# EAGLE schematic od2r_redraw (EAGLE 9.6.0)
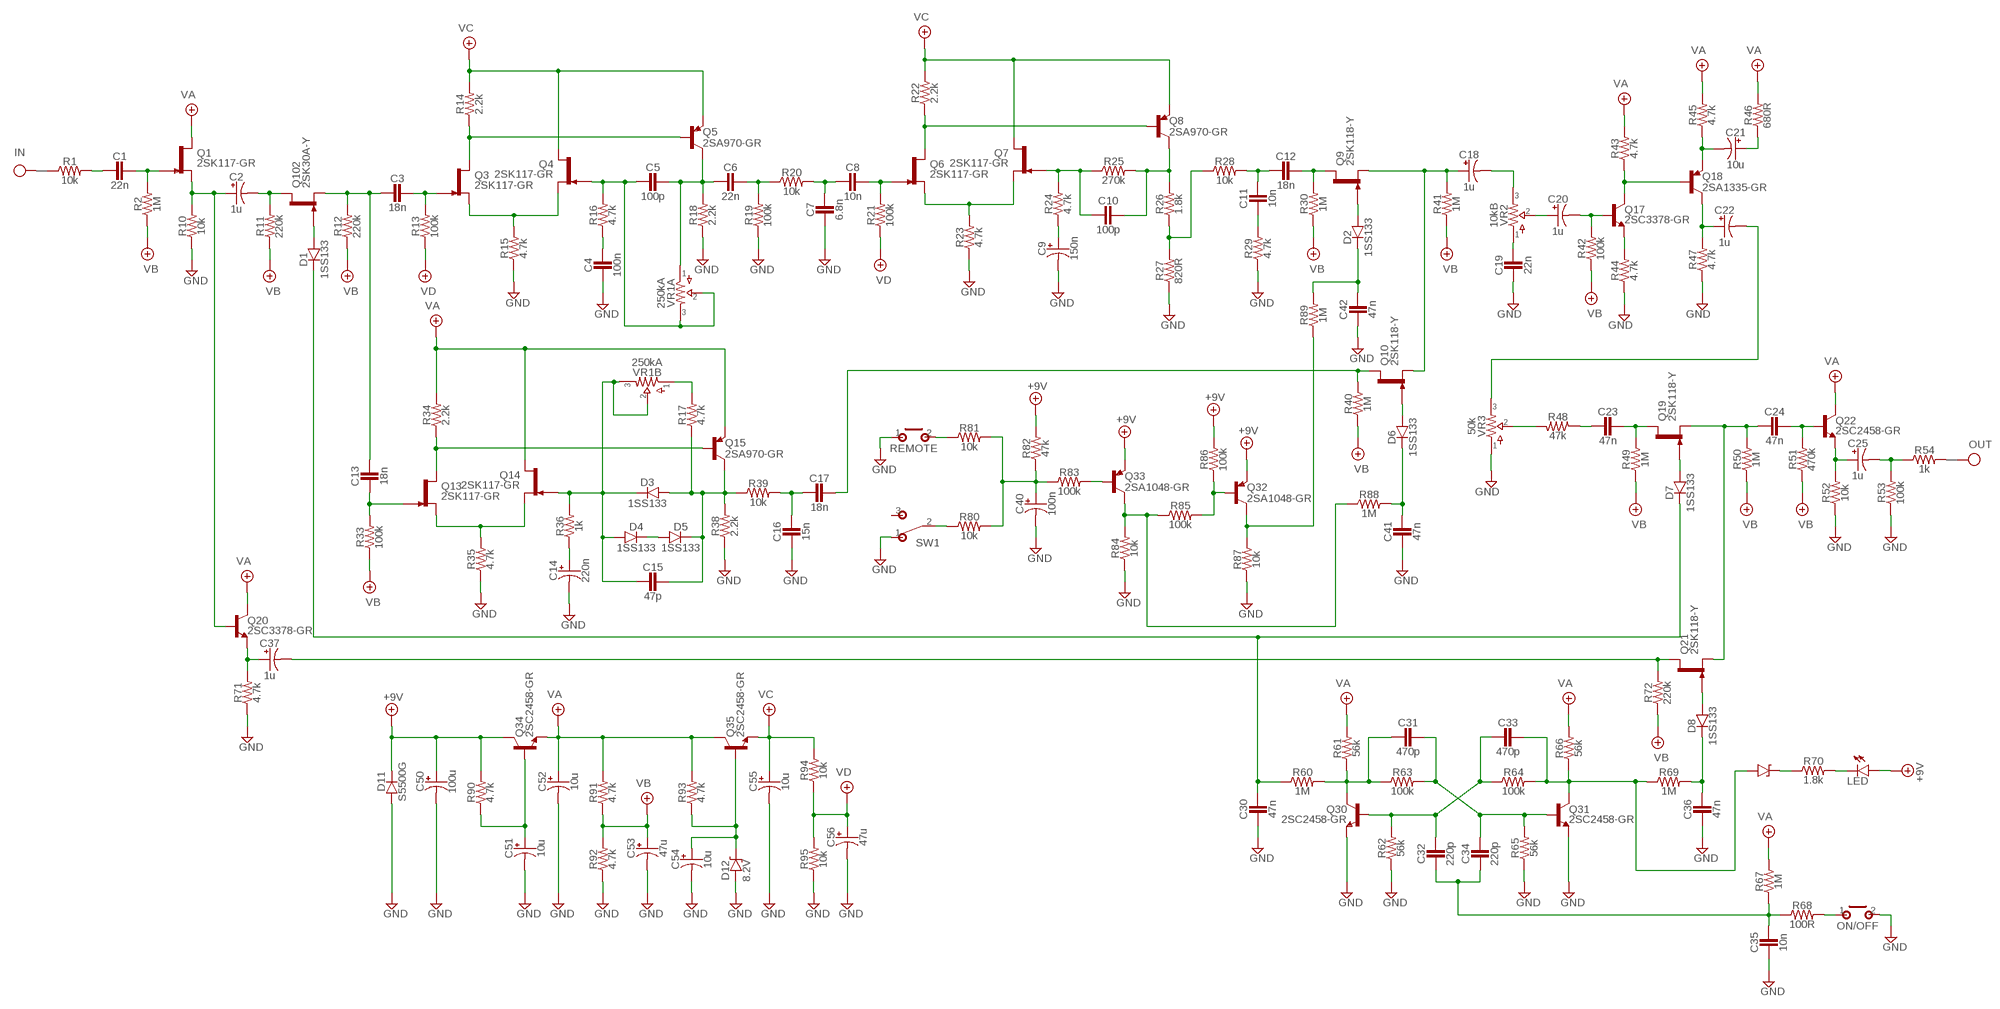
[diagram p0: schematic, sheet 1]

## Parts
C1  22n  CER/FILMBOX.1  [BOX_SMALL]
C2  1u  0400  [040_020]
C3  18n  CER/FILMBOX.1  [BOX_SMALL]
C4  100n  CER/FILMBOX.1  [BOX_SMALL]
C5  100p  CER/FILMBOX.1  [BOX_SMALL]
C6  22n  CER/FILMBOX.1  [BOX_SMALL]
C7  6.8n  CER/FILMBOX.1  [BOX_SMALL]
C8  10n  CER/FILMBOX.1  [BOX_SMALL]
C9  150n  0400  [040_020]
C10  100p  CER/FILMBOX.1  [BOX_SMALL]
C11  10n  CER/FILMBOX.1  [BOX_SMALL]
C12  18n  CER/FILMBOX.1  [BOX_SMALL]
C13  18n  CER/FILMBOX.1  [BOX_SMALL]
C14  220n  0400  [040_020]
C15  47p  CER/FILMBOX.1  [BOX_SMALL]
C16  15n  CER/FILMBOX.1  [BOX_SMALL]
C17  18n  CER/FILMBOX.1  [BOX_SMALL]
C18  1u  0400  [040_020]
C19  22n  CER/FILMBOX.1  [BOX_SMALL]
C20  1u  0400  [040_020]
C21  10u  0400  [040_020]
C22  1u  0400  [040_020]
C23  47n  CER/FILMBOX.1  [BOX_SMALL]
C24  47n  CER/FILMBOX.1  [BOX_SMALL]
C25  1u  0400  [040_020]
C30  47n  CER/FILMBOX.1  [BOX_SMALL]
C31  470p  CER/FILMBOX.1  [BOX_SMALL]
C32  220p  CER/FILMBOX.1  [BOX_SMALL]
C33  470p  CER/FILMBOX.1  [BOX_SMALL]
C34  220p  CER/FILMBOX.1  [BOX_SMALL]
C35  10n  CER/FILMBOX.1  [BOX_SMALL]
C36  47n  CER/FILMBOX.1  [BOX_SMALL]
C37  1u  0400  [040_020]
C40  100n  0400  [040_020]
C41  47n  CER/FILMBOX.1  [BOX_SMALL]
C42  47n  CER/FILMBOX.1  [BOX_SMALL]
C50  100u  0400  [040_020]
C51  10u  0400  [040_020]
C52  10u  0400  [040_020]
C53  47u  0400  [040_020]
C54  10u  0400  [040_020]
C55  10u  0400  [040_020]
C56  47u  0400  [040_020]
D1  1SS133  DO35.2  [DO35-2]
D2  1SS133  DO35.2  [DO35-2]
D3  1SS133  DO35.2  [DO35-2]
D4  1SS133  DO35.2  [DO35-2]
D5  1SS133  DO35.2  [DO35-2]
D6  1SS133  DO35.2  [DO35-2]
D7  1SS133  DO35.2  [DO35-2]
D8  1SS133  DO35.2  [DO35-2]
D11  S5500G  DO35.2  [DO35-2]
D12  8.2V  ZENER.2  [DO41-2]
LED  LED  [3MM_D]
ON/OFF  MOMENTARY  [SPST]
Q1  2SK117-GR  2N3819TO-92S  [TO92-]
Q3  2SK117-GR  2N3819TO-92S  [TO92-]
Q4  2SK117-GR  2N3819TO-92S  [TO92-]
Q5  2SA970-GR  2N3906  [TO92]
Q6  2SK117-GR  2N3819TO-92S  [TO92-]
Q7  2SK117-GR  2N3819TO-92S  [TO92-]
Q8  2SA970-GR  2N3906  [TO92]
Q9  2SK118-Y  2N3819TO-92S  [TO92-]
Q10  2SK118-Y  2N3819TO-92S  [TO92-]
Q13  2SK117-GR  2N3819TO-92S  [TO92-]
Q14  2SK117-GR  2N3819TO-92S  [TO92-]
Q15  2SA970-GR  2N3906  [TO92]
Q17  2SC3378-GR  2N3904  [TO92-]
Q18  2SA1335-GR  2N3906  [TO92]
Q19  2SK118-Y  2N3819TO-92S  [TO92-]
Q20  2SC3378-GR  2N3904  [TO92-]
Q21  2SK118-Y  2N3819TO-92S  [TO92-]
Q22  2SC2458-GR  2SC828A  [TO92-]
Q30  2SC2458-GR  2SC828A  [TO92-]
Q31  2SC2458-GR  2SC828A  [TO92-]
Q32  2SA1048-GR  2N3906  [TO92]
Q33  2SA1048-GR  2N3906  [TO92]
Q34  2SC2458-GR  2SC828A  [TO92-]
Q35  2SC2458-GR  2SC828A  [TO92-]
Q102  2SK30A-Y  2N3819TO-92S  [TO92-]
R1  10k  R_.3B  [R0207/3]
R2  1M  R_.3B  [R0207/3]
R10  10k  R_.3B  [R0207/3]
R11  220k  R_.3B  [R0207/3]
R12  220k  R_.3B  [R0207/3]
R13  100k  R_.3B  [R0207/3]
R14  2.2k  R_.3B  [R0207/3]
R15  4.7k  R_.3B  [R0207/3]
R16  4.7k  R_.3B  [R0207/3]
R17  4.7k  R_.3B  [R0207/3]
R18  2.2k  R_.3B  [R0207/3]
R19  100k  R_.3B  [R0207/3]
R20  10k  R_.3B  [R0207/3]
R21  100k  R_.3B  [R0207/3]
R22  2.2k  R_.3B  [R0207/3]
R23  4.7k  R_.3B  [R0207/3]
R24  4.7k  R_.3B  [R0207/3]
R25  270k  R_.3B  [R0207/3]
R26  1.8k  R_.3B  [R0207/3]
R27  820R  R_.3B  [R0207/3]
R28  10k  R_.3B  [R0207/3]
R29  4.7k  R_.3B  [R0207/3]
R30  1M  R_.3B  [R0207/3]
R33  100k  R_.3B  [R0207/3]
R34  2.2k  R_.3B  [R0207/3]
R35  4.7k  R_.3B  [R0207/3]
R36  1k  R_.3B  [R0207/3]
R38  2.2k  R_.3B  [R0207/3]
R39  10k  R_.3B  [R0207/3]
R40  1M  R_.3B  [R0207/3]
R41  1M  R_.3B  [R0207/3]
R42  100k  R_.3B  [R0207/3]
R43  4.7k  R_.3B  [R0207/3]
R44  4.7k  R_.3B  [R0207/3]
R45  4.7k  R_.3B  [R0207/3]
R46  680R  R_.3B  [R0207/3]
R47  4.7k  R_.3B  [R0207/3]
R48  47k  R_.3B  [R0207/3]
R49  1M  R_.3B  [R0207/3]
R50  1M  R_.3B  [R0207/3]
R51  470k  R_.3B  [R0207/3]
R52  10k  R_.3B  [R0207/3]
R53  100k  R_.3B  [R0207/3]
R54  1k  R_.3B  [R0207/3]
R60  1M  R_.3B  [R0207/3]
R61  56k  R_.3B  [R0207/3]
R62  56k  R_.3B  [R0207/3]
R63  100k  R_.3B  [R0207/3]
R64  100k  R_.3B  [R0207/3]
R65  56k  R_.3B  [R0207/3]
R66  56k  R_.3B  [R0207/3]
R67  1M  R_.3B  [R0207/3]
R68  100R  R_.3B  [R0207/3]
R69  1M  R_.3B  [R0207/3]
R70  1.8k  R_.3B  [R0207/3]
R71  4.7k  R_.3B  [R0207/3]
R72  220k  R_.3B  [R0207/3]
R80  10k  R_.3B  [R0207/3]
R81  10k  R_.3B  [R0207/3]
R82  47k  R_.3B  [R0207/3]
R83  100k  R_.3B  [R0207/3]
R84  10k  R_.3B  [R0207/3]
R85  100k  R_.3B  [R0207/3]
R86  100k  R_.3B  [R0207/3]
R87  10k  R_.3B  [R0207/3]
R88  1M  R_.3B  [R0207/3]
R89  1M  R_.3B  [R0207/3]
R90  4.7k  R_.3B  [R0207/3]
R91  4.7k  R_.3B  [R0207/3]
R92  4.7k  R_.3B  [R0207/3]
R93  4.7k  R_.3B  [R0207/3]
R94  10k  R_.3B  [R0207/3]
R95  10k  R_.3B  [R0207/3]
REMOTE  MOMENTARY  [SPST]
SW1  SPDT  [M9040P]
VR1A  250kA  POTS16MM  [16MM]
VR1B  250kA  POTS16MM  [16MM]
VR2  10kB  POTS16MM  [16MM]
VR3  50k  POTS16MM  [16MM]
   ZENER.2  [DO41-2]

## Nets
+9V: C50.+ D11.C LED.ANODE(A) Q32.3(E) Q33.3(E) Q34.2(C) R82.2 R86.2 R90.2
GND: C4.2 C7.2 C9.- C14.- C16.2 C19.2 C30.2 C35.2 C36.2 C40.- C41.2 C42.2 C50.- C51.- C52.- C53.- C54.- C55.- C56.- D11.A D12.A ON/OFF.2(S) Q30.3(E) Q31.3(E) R10.1 R15.1 R18.1 R19.1 R23.1 R27.1 R29.1 R35.1 R38.1 R44.1 R47.1 R52.1 R53.1 R62.1 R65.1 R71.1 R84.1 R87.1 R92.1 R95.1 REMOTE.1(P) SW1.1(O) VR3.1
N$1: D4.C D5.A
N$2: R17.2 VR1B.1
N$3: Q32.1(C) R87.2 R89.1
N$4: C51.+ Q34.1(B) R90.1
N$5: Q32.2(B) R85.2 R86.1
N$6: C54.+ D12.C Q35.1(B) R93.1
N$7: C1.2 R1.2
N$8: C1.1 Q1.2(G) R2.2
N$9: C2.- Q102.3(D) R11.2
N$10: D1.A Q102.2(G)
N$11: Q33.1(C) R84.2 R85.1 R88.1
N$12: Q33.2(B) R83.2
N$13: C3.2 C13.1 Q102.1(S) R12.2
N$14: C3.1 Q3.2(G) R13.2
N$15: Q3.1(S) Q4.1(S) R15.2
N$16: Q3.3(D) Q5.2(B) R14.1
N$17: C13.2 Q13.2(G) R33.2
N$18: C4.1 R16.1
N$19: C5.1 C6.2 Q5.1(C) R18.2 VR1A.1
N$20: C6.1 R19.2 R20.1
N$21: C7.1 C8.2 R20.2
N$22: C8.1 Q6.2(G) R21.2
N$23: Q6.1(S) Q7.1(S) R23.2
N$24: Q6.3(D) Q8.2(B) R22.1
N$25: C10.1 Q8.1(C) R25.2 R26.2
N$26: C11.1 C12.2 R28.2
N$27: C40.+ R80.2 R81.2 R82.1 R83.1
N$28: R26.1 R27.2 R28.1
N$29: C31.2 Q30.2(C) R60.2 R61.1 R63.1
N$30: C10.2 Q7.2(G) R24.2 R25.1
N$31: C33.1 Q31.2(C) R64.2 R66.1 R69.1  .A
N$32: C32.1 C33.2 Q30.1(B) R62.2 R64.1
N$33: C9.+ R24.1
N$34: C31.1 C34.1 Q31.1(B) R63.2 R65.2
N$35: C32.2 C34.2 C35.1 R67.1 R68.1
N$36: C11.2 R29.2
N$37: C12.1 Q9.3(D) R30.2
N$38: C18.+ Q9.1(S) Q10.1(S) R41.2
N$39: D2.A Q9.2(G)
N$40: C5.2 Q4.2(G) R16.2 VR1A.2 VR1A.3
N$41: R80.1 SW1.2(P)
N$42: Q13.1(S) Q14.1(S) R35.2
N$43: Q13.3(D) Q15.2(B) R34.1
N$44: C15.2 D3.C D4.A Q14.2(G) R36.2 VR1B.2 VR1B.3
N$45: C14.+ R36.1
N$46: C16.1 C17.2 R39.2
N$47: C18.- VR2.3
N$48: C15.1 D3.A D5.C Q15.1(C) R17.1 R38.2 R39.1
N$49: R81.1 REMOTE.2(S)
N$50: C20.+ VR2.2
N$51: C20.- Q17.2(B) R42.2
N$52: C19.1 VR2.1
N$53: C17.1 Q10.3(D) R40.2
N$54: D6.A Q10.2(G)
N$55: C41.1 D6.C R88.2
N$56: Q17.3(E) R44.2
N$57: C42.1 D2.C R89.2
N$58: R48.2 VR3.2
N$59: C23.2 R48.1
N$60: Q17.1(C) Q18.2(B) R43.1
N$61: D8.A Q21.2(G)
N$62: C36.1 D8.C R69.2
N$63: C37.- Q21.3(D) R72.2
N$64: C23.1 Q19.3(D) R49.2
N$65: D7.A Q19.2(G)
N$66: ON/OFF.1(P) R68.2
N$67: C24.2 Q19.1(S) Q21.1(S) R50.2
N$68: C24.1 Q22.1(B) R51.2
N$69: C25.+ Q22.3(E) R52.2
N$70: C25.- R53.2 R54.1
N$71: C21.- Q18.3(E) R45.1
N$72: C30.1 D1.C D7.C R60.1
N$73: R70.1  .C
N$74: LED.P$1(C) R70.2
N$75: C21.+ R46.1
N$76: C22.+ Q18.1(C) R47.2
N$77: C22.- VR3.3
N$78: C37.+ Q20.3(E) R71.2
N$111: C2.+ Q1.1(S) Q20.2(B) R10.2
VA: C52.+ Q1.3(D) Q14.3(D) Q15.3(E) Q20.1(C) Q22.2(C) Q34.3(E) Q35.2(C) R34.2 R43.2 R45.2 R46.2 R61.2 R66.2 R67.2 R91.2 R93.2
VB: C53.+ R2.1 R11.1 R12.1 R30.1 R33.1 R40.1 R41.1 R42.1 R49.1 R50.1 R51.1 R72.1 R91.1 R92.2
VC: C55.+ Q4.3(D) Q5.3(E) Q7.3(D) Q8.3(E) Q35.3(E) R14.2 R22.2 R94.2
VD: C56.+ R13.1 R21.1 R94.1 R95.2
Unconnected: R1.1 R54.2 SW1.3(S)

## Library data of the parts
C1 C3-C8 C10-C13 C15-C17 C19 C23 C24 C30-C36 C41 C42 = pedals-capacitors-film:CER/FILM: 47 - 120pF Xicon Ceramic Disc 2.5mm lead spacing
C2 C9 C14 C18 C20-C22 C25 C37 C40 C50-C56 = pedals-capacitors-elec:040
D1-D8 D11 = pedals-diodes:DO35: DO-35 Package Diodes: 1N914
D12   = pedals-diodes:ZENER
LED = pedals-diodes:LED
ON/OFF REMOTE = pedals-switches:MOMENTARY
Q1 Q3 Q4 Q6 Q7 Q9 Q10 Q13 Q14 Q19 Q21 Q102 = pedals-transistors:2N3819: N-CHANNEL FET
Q5 Q8 Q15 Q18 Q32 Q33 = pedals-transistors:2N3906: PNP Transistor
Q17 Q20 = pedals-transistors:2N3904: NPN Transistor
Q22 Q30 Q31 Q34 Q35 = pedals-transistors:2SC828A
R1 R2 R10-R30 R33-R36 R38-R54 R60-R72 R80-R95 = pedals-resistors:R_
SW1 = pedals-switches:SPDT: TOGGLE SWITCH Marquardt
VR1A VR1B VR2 VR3 = pedals-potentiometers:POTS